# Altium schematic sheet Amplifier.SchDoc
size A; SheetNumber: 3; SheetTotal: 5
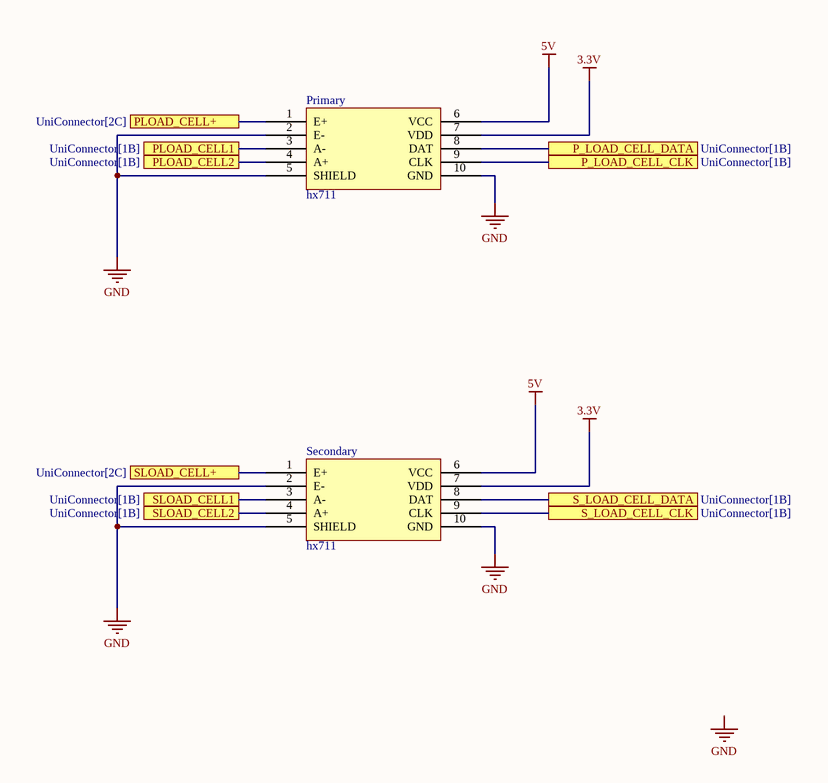
[diagram p0: Amplifier.SchDoc]

## Parts
Primary  hx711  [PCBComponent_1]
Secondary  hx711  [PCBComponent_1]

## Ports
P_LOAD_CELL_CLK (see UniConnector[1B]), P_LOAD_CELL_DATA (see UniConnector[1B]), PLOAD_CELL1 (see UniConnector[1B]), PLOAD_CELL2 (see UniConnector[1B]), PLOAD_CELL+ (see UniConnector[2C]), S_LOAD_CELL_CLK (see UniConnector[1B]), S_LOAD_CELL_DATA (see UniConnector[1B]), SLOAD_CELL1 (see UniConnector[1B]), SLOAD_CELL2 (see UniConnector[1B]), SLOAD_CELL+ (see UniConnector[2C])

## Nets
3.3V: Primary.7(VDD) Secondary.7(VDD)
5V: Primary.6(VCC) Secondary.6(VCC)
GND: Primary.2(E-) Primary.5(SHIELD) Primary.10(GND) Secondary.2(E-) Secondary.5(SHIELD) Secondary.10(GND)
P_LOAD_CELL_CLK: Primary.9(CLK) ; port P_LOAD_CELL_CLK
P_LOAD_CELL_DATA: Primary.8(DAT) ; port P_LOAD_CELL_DATA
PLOAD_CELL1: Primary.3(A-) ; port PLOAD_CELL1
PLOAD_CELL2: Primary.4(A+) ; port PLOAD_CELL2
PLOAD_CELL+: Primary.1(E+) ; port PLOAD_CELL+
S_LOAD_CELL_CLK: Secondary.9(CLK) ; port S_LOAD_CELL_CLK
S_LOAD_CELL_DATA: Secondary.8(DAT) ; port S_LOAD_CELL_DATA
SLOAD_CELL1: Secondary.3(A-) ; port SLOAD_CELL1
SLOAD_CELL2: Secondary.4(A+) ; port SLOAD_CELL2
SLOAD_CELL+: Secondary.1(E+) ; port SLOAD_CELL+

## Notes on the sheet
- Labels drawn without touching a wire or pin: GND

## Library data of the parts
Primary Secondary = Component_1